# EAGLE design board (EAGLE 6.4)

## Sheet 1 of 3
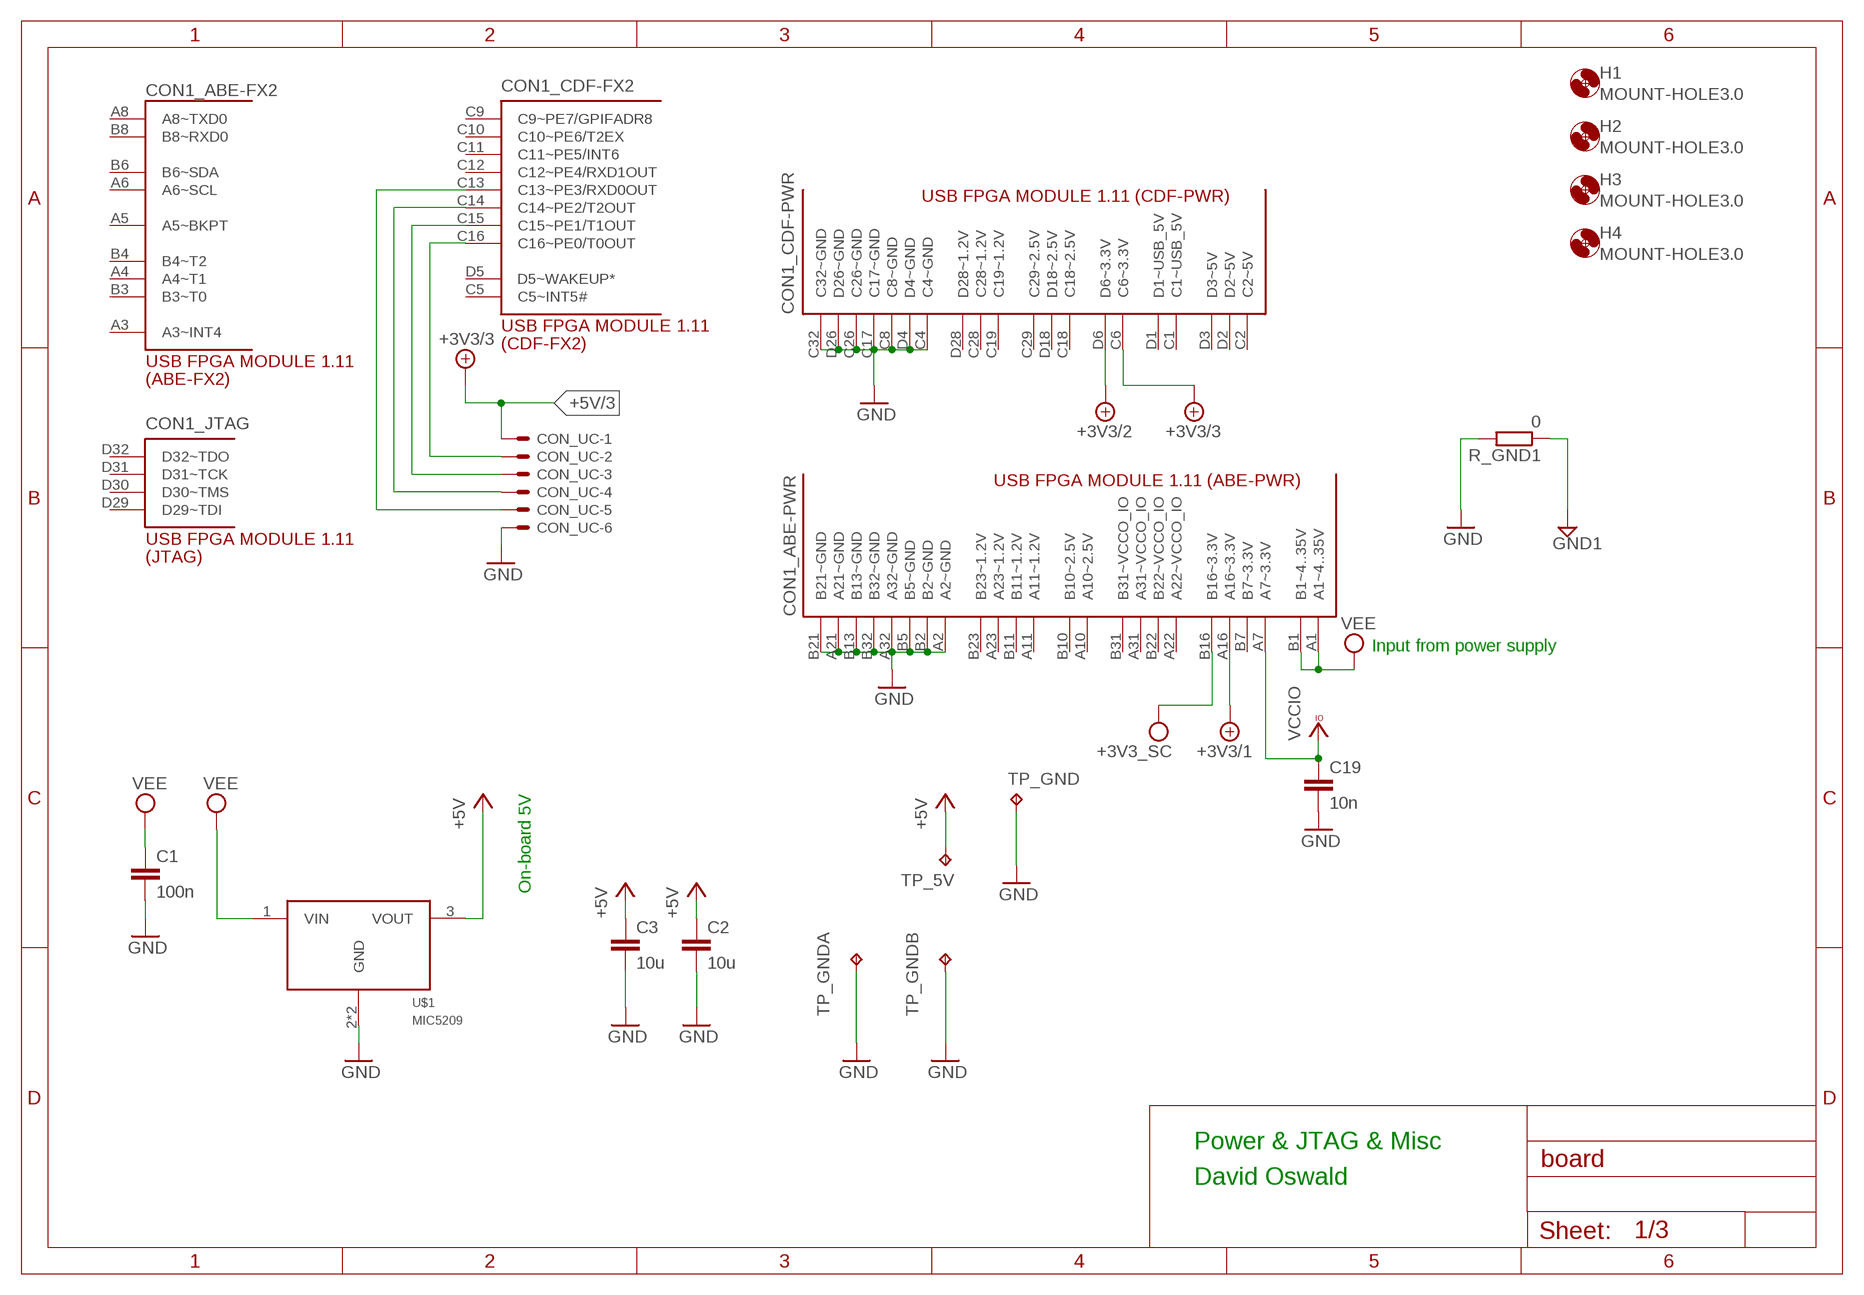
[diagram p0: schematic, sheet 1]

### Parts
C1  100n  C-EUC0805K  [C0805K]
C2  10u  C-EUC0805K  [C0805K]
C3  10u  C-EUC0805K  [C0805K]
C19  10n  C-EUC0805K  [C0805K]
CON1  USB-FPGA1.11  [USB-FPGA1.11]
CON_UC  22-23-2061  [22-23-2061]
H1  MOUNT-HOLE3.0  [3,0]
H2  MOUNT-HOLE3.0  [3,0]
H3  MOUNT-HOLE3.0  [3,0]
H4  MOUNT-HOLE3.0  [3,0]
R_GND1  0  R-EU_R0805  [R0805]
TP_5V  TPB1,27  [B1,27]
TP_GND  TPB1,27  [B1,27]
TP_GNDA  TPPAD1-13  [P1-13]
TP_GNDB  TPPAD1-13  [P1-13]
U$1  MIC5209  [SOT223-3]

### Nets
+5V: C2.1 C3.1 TP_5V.TP U$1.3(VOUT) ; also sheet 2,3
+5V/1: CON1.A16(_ABE-PWR:A16~3.3V) ; supply symbol labelled +3V3/1 ; also sheet 2
+5V/2: CON1.D6(_CDF-PWR:D6~3.3V) ; supply symbol labelled +3V3/2 ; also sheet 3
+5V/3: CON1.C6(_CDF-PWR:C6~3.3V) CON_UC.1 ; supply symbol labelled +3V3/3 ; also sheet 3
GND: C1.2 C2.2 C3.2 C19.2 CON1.A2(_ABE-PWR:A2~GND) CON1.A21(_ABE-PWR:A21~GND) CON1.A32(_ABE-PWR:A32~GND) CON1.B2(_ABE-PWR:B2~GND) CON1.B5(_ABE-PWR:B5~GND) CON1.B13(_ABE-PWR:B13~GND) CON1.B21(_ABE-PWR:B21~GND) CON1.B32(_ABE-PWR:B32~GND) CON1.C4(_CDF-PWR:C4~GND) CON1.C8(_CDF-PWR:C8~GND) CON1.C17(_CDF-PWR:C17~GND) CON1.C26(_CDF-PWR:C26~GND) CON1.C32(_CDF-PWR:C32~GND) CON1.D4(_CDF-PWR:D4~GND) CON1.D26(_CDF-PWR:D26~GND) CON_UC.6 R_GND1.2 TP_GND.TP TP_GNDA.TP TP_GNDB.TP U$1.2(GND) U$1.4(GND) ; also sheet 2,3
GND1: R_GND1.1 ; also sheet 2
N$60: CON1.C13(_CDF-FX2:C13~PE3/RXD0OUT) CON_UC.5
N$61: CON1.C14(_CDF-FX2:C14~PE2/T2OUT) CON_UC.4
N$62: CON1.C15(_CDF-FX2:C15~PE1/T1OUT) CON_UC.3
N$63: CON1.C16(_CDF-FX2:C16~PE0/T0OUT) CON_UC.2
VCCIO: C19.1 CON1.A7(_ABE-PWR:A7~3.3V) ; also sheet 2
VEE: C1.1 CON1.A1(_ABE-PWR:A1~4..35V) CON1.B1(_ABE-PWR:B1~4..35V) U$1.1(VIN)
VPP: CON1.B16(_ABE-PWR:B16~3.3V) ; supply symbol labelled +3V3_SC ; also sheet 3
Unconnected: CON1.A3(_ABE-FX2:A3~INT4) CON1.A4(_ABE-FX2:A4~T1) CON1.A5(_ABE-FX2:A5~BKPT) CON1.A6(_ABE-FX2:A6~SCL) CON1.A8(_ABE-FX2:A8~TXD0) CON1.A10(_ABE-PWR:A10~2.5V) CON1.A11(_ABE-PWR:A11~1.2V) CON1.A22(_ABE-PWR:A22~VCCO_IO) CON1.A23(_ABE-PWR:A23~1.2V) CON1.A31(_ABE-PWR:A31~VCCO_IO) CON1.B3(_ABE-FX2:B3~T0) CON1.B4(_ABE-FX2:B4~T2) CON1.B6(_ABE-FX2:B6~SDA) CON1.B7(_ABE-PWR:B7~3.3V) CON1.B8(_ABE-FX2:B8~RXD0) CON1.B10(_ABE-PWR:B10~2.5V) CON1.B11(_ABE-PWR:B11~1.2V) CON1.B22(_ABE-PWR:B22~VCCO_IO) CON1.B23(_ABE-PWR:B23~1.2V) CON1.B31(_ABE-PWR:B31~VCCO_IO) CON1.C1(_CDF-PWR:C1~USB_5V) CON1.C2(_CDF-PWR:C2~5V) CON1.C5(_CDF-FX2:C5~INT5#) CON1.C9(_CDF-FX2:C9~PE7/GPIFADR8) CON1.C10(_CDF-FX2:C10~PE6/T2EX) CON1.C11(_CDF-FX2:C11~PE5/INT6) CON1.C12(_CDF-FX2:C12~PE4/RXD1OUT) CON1.C18(_CDF-PWR:C18~2.5V) CON1.C19(_CDF-PWR:C19~1.2V) CON1.C28(_CDF-PWR:C28~1.2V) CON1.C29(_CDF-PWR:C29~2.5V) CON1.D1(_CDF-PWR:D1~USB_5V) CON1.D2(_CDF-PWR:D2~5V) CON1.D3(_CDF-PWR:D3~5V) CON1.D5(_CDF-FX2:D5~WAKEUP*) CON1.D18(_CDF-PWR:D18~2.5V) CON1.D28(_CDF-PWR:D28~1.2V) CON1.D29(_JTAG:D29~TDI) CON1.D30(_JTAG:D30~TMS) CON1.D31(_JTAG:D31~TCK) CON1.D32(_JTAG:D32~TDO)

### Notes on the sheet
- Input from power supply
- On-board 5V
- Power & JTAG & Misc
- David Oswald

## Sheet 2 of 3
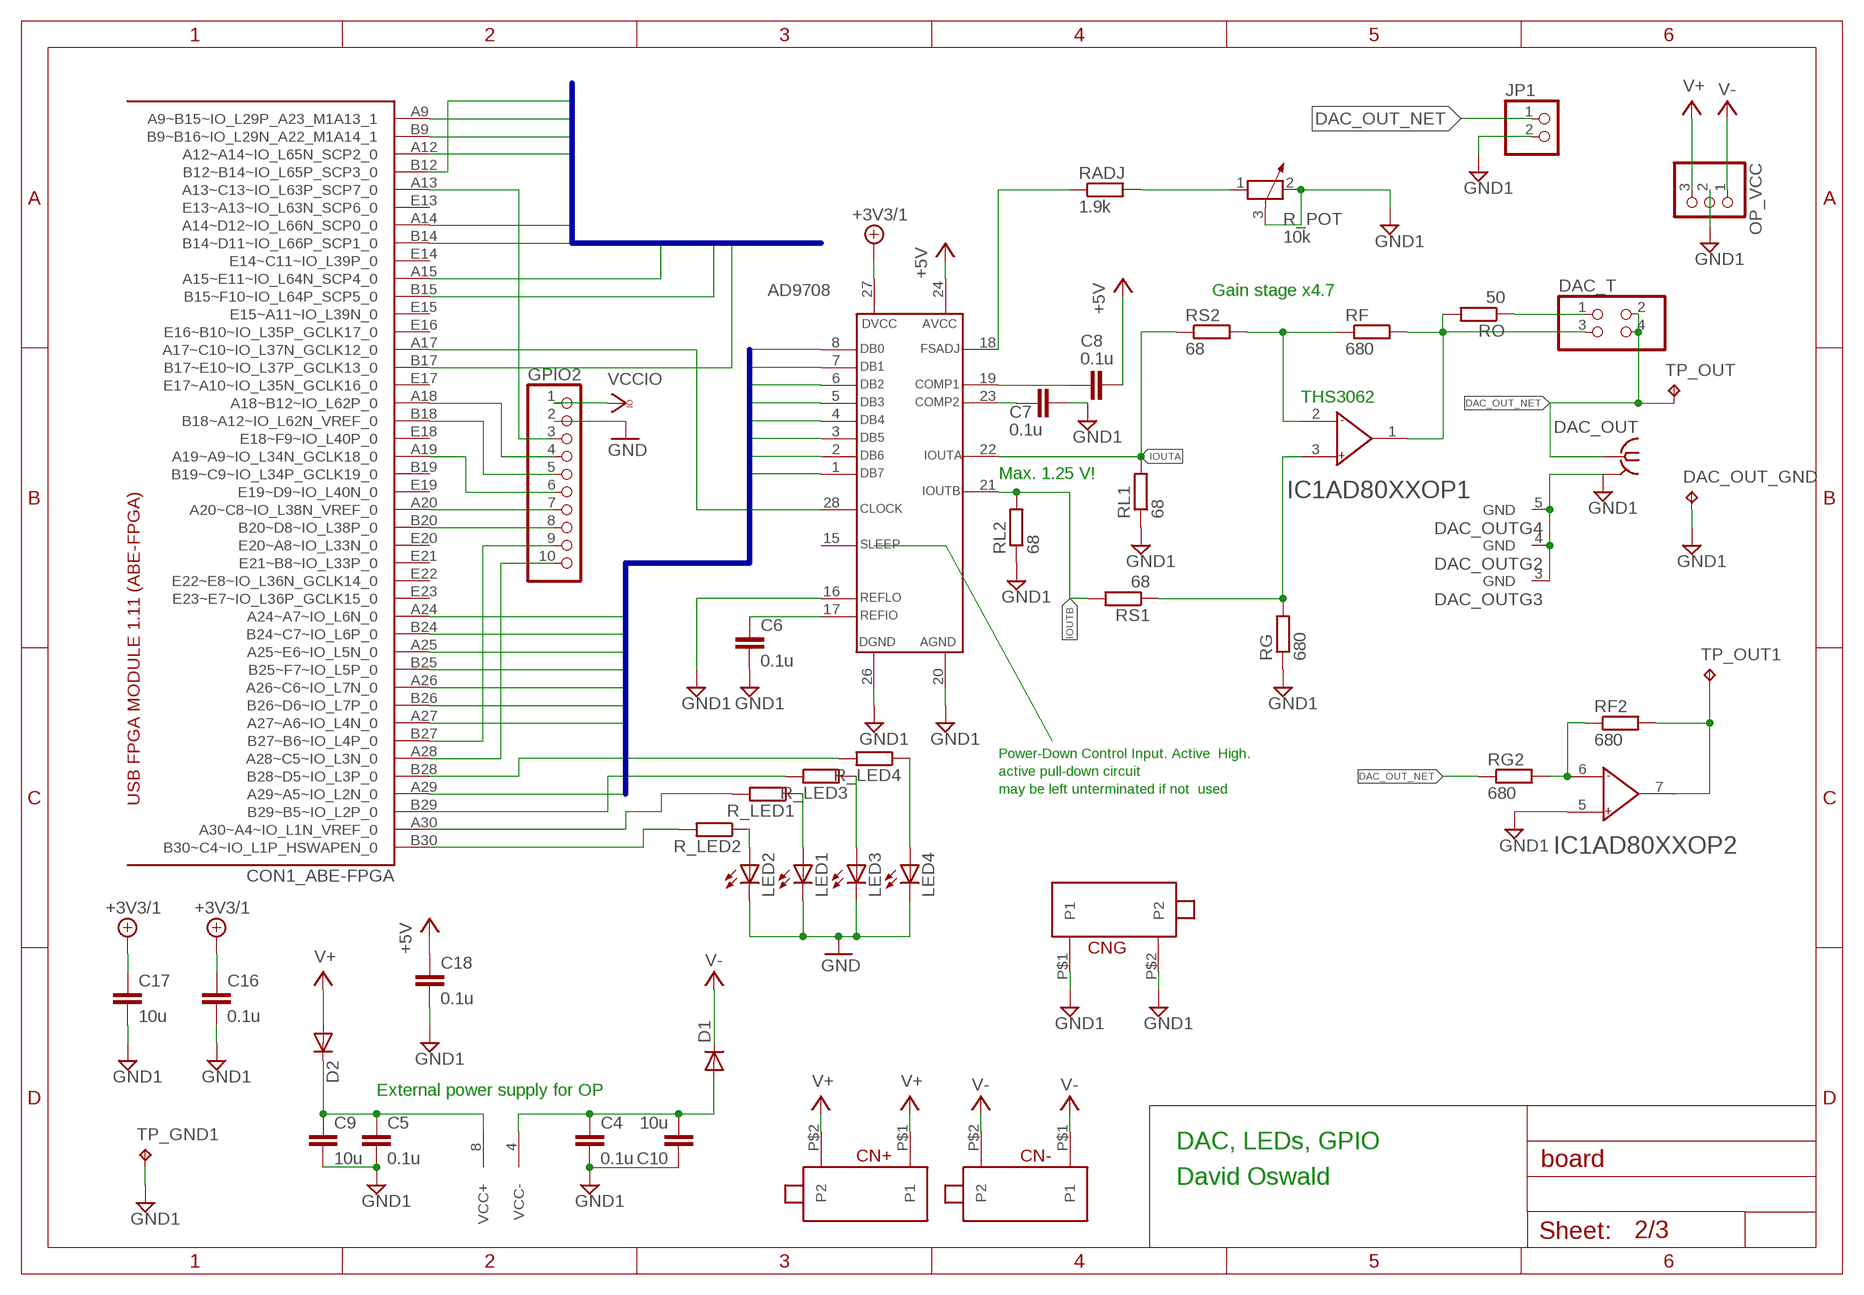
[diagram p1: schematic, sheet 2]

### Parts
AD9708  AD7908  [SO28W]
C4  0.1u  C-EUC0805K  [C0805K]
C5  0.1u  C-EUC0805K  [C0805K]
C6  0.1u  C-EUC0805K  [C0805K]
C7  0.1u  C-EUC0805K  [C0805K]
C8  0.1u  C-EUC0805K  [C0805K]
C9  10u  C-EUC0805K  [C0805K]
C10  10u  C-EUC0805K  [C0805K]
C16  0.1u  C-EUC0805K  [C0805K]
C17  10u  C-EUC0805K  [C0805K]
C18  0.1u  C-EUC0805K  [C0805K]
CN+  24243  [24_243]
CN-  24243  [24_243]
CNG  24243  [24_243]
D1  DIODE-SOD123  [SOD123]
D2  DIODE-SOD123  [SOD123]
DAC_OUT  BU-SMA-V  [BU-SMA-V]
DAC_OUT_GND  TPB1,27  [B1,27]
DAC_T  PINHD-2X2  [2X02]
GPIO2  PINHD-1X10  [1X10]
IC1  AD80XX  [SO08]
JP1  PINHD-1X2  [1X02]
LED1  LEDCHIPLED_0805  [CHIPLED_0805]
LED2  LEDCHIPLED_0805  [CHIPLED_0805]
LED3  LEDCHIPLED_0805  [CHIPLED_0805]
LED4  LEDCHIPLED_0805  [CHIPLED_0805]
OP_VCC  PINHD-1X3  [1X03]
R_LED1  R-EU_R0805  [R0805]
R_LED2  R-EU_R0805  [R0805]
R_LED3  R-EU_R0805  [R0805]
R_LED4  R-EU_R0805  [R0805]
R_POT  10k  POTENTIOMETER_PT_SPIN  [PT-SPIN]
RADJ  1.9k  R-EU_R0805  [R0805]
RF  680  R-EU_R0805  [R0805]
RF2  680  R-EU_R0805  [R0805]
RG  680  R-EU_R0805  [R0805]
RG2  680  R-EU_R0805  [R0805]
RL1  68  R-EU_R0805  [R0805]
RL2  68  R-EU_R0805  [R0805]
RO  50  R-EU_R0805  [R0805]
RS1  68  R-EU_R0805  [R0805]
RS2  68  R-EU_R0805  [R0805]
TP_GND1  TPB1,27  [B1,27]
TP_OUT  TPB1,27  [B1,27]
TP_OUT1  TPB1,27  [B1,27]

### Nets
+5V: AD9708.24(AVCC) C8.1 C18.1 ; also sheet 1,3
+5V/1: AD9708.27(DVCC) C16.1 C17.1 ; supply symbol labelled +3V3/1 ; also sheet 1
CLK: AD9708.28(CLOCK) CON1.A17(_ABE-FPGA:A17~C10~IO_L37N_GCLK12_0)
CLK_SC: CON1.A15(_ABE-FPGA:A15~E11~IO_L64N_SCP4_0) ; also sheet 3
COMP1: AD9708.19(COMP1) C8.2
COMP2: AD9708.23(COMP2) C7.1
DAC_OUT_NET: DAC_OUT.1 DAC_T.2 DAC_T.4 JP1.1 RG2.1 TP_OUT.TP
DB0: AD9708.8(DB0) CON1.A29(_ABE-FPGA:A29~A5~IO_L2N_0)
DB1: AD9708.7(DB1) CON1.A27(_ABE-FPGA:A27~A6~IO_L4N_0)
DB2: AD9708.6(DB2) CON1.B26(_ABE-FPGA:B26~D6~IO_L7P_0)
DB3: AD9708.5(DB3) CON1.A26(_ABE-FPGA:A26~C6~IO_L7N_0)
DB4: AD9708.4(DB4) CON1.A25(_ABE-FPGA:A25~E6~IO_L5N_0)
DB5: AD9708.3(DB5) CON1.B25(_ABE-FPGA:B25~F7~IO_L5P_0)
DB6: AD9708.2(DB6) CON1.A24(_ABE-FPGA:A24~A7~IO_L6N_0)
DB7: AD9708.1(DB7) CON1.B24(_ABE-FPGA:B24~C7~IO_L6P_0)
FSADJ: AD9708.18(FSADJ) RADJ.1
GND: GPIO2.2 LED1.C LED2.C LED3.C LED4.C ; also sheet 1,3
GND1: AD9708.16(REFLO) AD9708.20(AGND) AD9708.26(DGND) C4.2 C5.2 C6.2 C7.2 C9.2 C10.1 C16.2 C17.2 C18.2 CNG.P$1(P1) CNG.P$2(P2) DAC_OUT.2(GND) DAC_OUT.3(GND) DAC_OUT.4(GND) DAC_OUT.5(GND) DAC_OUT_GND.TP IC1.5(AD80XXOP2:IN+) JP1.2 OP_VCC.2 R_POT.2 R_POT.3 RG.1 RL1.1 RL2.1 TP_GND1.TP ; also sheet 1
IO: CON1.B9(_ABE-FPGA:B9~B16~IO_L29N_A22_M1A14_1) ; also sheet 3
IOUTA: AD9708.22(IOUTA) RL1.2 RS2.1
IOUTB: AD9708.21(IOUTB) RL2.2 RS1.2
N$1: CON1.A13(_ABE-FPGA:A13~C13~IO_L63P_SCP7_0) GPIO2.3
N$2: CON1.A18(_ABE-FPGA:A18~B12~IO_L62P_0) GPIO2.4
N$3: CON1.B18(_ABE-FPGA:B18~A12~IO_L62N_VREF_0) GPIO2.5
N$4: CON1.A19(_ABE-FPGA:A19~A9~IO_L34N_GCLK18_0) GPIO2.6
N$5: CON1.A20(_ABE-FPGA:A20~C8~IO_L38N_VREF_0) GPIO2.7
N$6: CON1.B20(_ABE-FPGA:B20~D8~IO_L38P_0) GPIO2.8
N$8: CON1.B27(_ABE-FPGA:B27~B6~IO_L4P_0) GPIO2.9
N$9: CON1.A28(_ABE-FPGA:A28~C5~IO_L3N_0) GPIO2.10
N$10: IC1.3(AD80XXOP1:IN+) RG.2 RS1.1
N$11: IC1.2(AD80XXOP1:IN-) RF.1 RS2.2
N$12: DAC_T.3 IC1.1(AD80XXOP1:OUT) RF.2 RO.2
N$18: DAC_T.1 RO.1
N$19: R_POT.1 RADJ.2
N$24: IC1.6(AD80XXOP2:IN-) RF2.1 RG2.2
N$33: IC1.7(AD80XXOP2:OUT) RF2.2 TP_OUT1.TP
N$34: LED2.A R_LED2.1
N$35: LED1.A R_LED1.1
N$50: LED3.A R_LED3.1
N$51: LED4.A R_LED4.1
N$53: CON1.B30(_ABE-FPGA:B30~C4~IO_L1P_HSWAPEN_0) R_LED2.2
N$54: CON1.A30(_ABE-FPGA:A30~A4~IO_L1N_VREF_0) R_LED1.2
N$55: CON1.B29(_ABE-FPGA:B29~B5~IO_L2P_0) R_LED3.2
N$56: CON1.B28(_ABE-FPGA:B28~D5~IO_L3P_0) R_LED4.2
PIN4: CON1.B14(_ABE-FPGA:B14~D11~IO_L66P_SCP1_0) ; also sheet 3
PIN6: CON1.A12(_ABE-FPGA:A12~A14~IO_L65N_SCP2_0) ; also sheet 3
PIN8: CON1.A9(_ABE-FPGA:A9~B15~IO_L29P_A23_M1A13_1) ; also sheet 3
REFIO: AD9708.17(REFIO) C6.1
RST: CON1.B15(_ABE-FPGA:B15~F10~IO_L64P_SCP5_0) ; also sheet 3
SHDN: CON1.B17(_ABE-FPGA:B17~E10~IO_L37P_GCLK13_0) ; also sheet 3
SW1: CON1.B12(_ABE-FPGA:B12~B14~IO_L65P_SCP3_0)
SW2: CON1.A14(_ABE-FPGA:A14~D12~IO_L66N_SCP0_0)
V+: CN+.P$1(P1) CN+.P$2(P2) D2.A OP_VCC.3
V-: CN-.P$1(P1) CN-.P$2(P2) D1.C OP_VCC.1
VCC+: C5.1 C9.1 D2.C IC1.8(SUPPLY:VCC+)
VCC-: C4.1 C10.2 D1.A IC1.4(SUPPLY:VCC-)
VCCIO: GPIO2.1 ; also sheet 1
Unconnected: AD9708.15(SLEEP) CON1.B19(_ABE-FPGA:B19~C9~IO_L34P_GCLK19_0) CON1.E13(_ABE-FPGA:E13~A13~IO_L63N_SCP6_0) CON1.E14(_ABE-FPGA:E14~C11~IO_L39P_0) CON1.E15(_ABE-FPGA:E15~A11~IO_L39N_0) CON1.E16(_ABE-FPGA:E16~B10~IO_L35P_GCLK17_0) CON1.E17(_ABE-FPGA:E17~A10~IO_L35N_GCLK16_0) CON1.E18(_ABE-FPGA:E18~F9~IO_L40P_0) CON1.E19(_ABE-FPGA:E19~D9~IO_L40N_0) CON1.E20(_ABE-FPGA:E20~A8~IO_L33N_0) CON1.E21(_ABE-FPGA:E21~B8~IO_L33P_0) CON1.E22(_ABE-FPGA:E22~E8~IO_L36N_GCLK14_0) CON1.E23(_ABE-FPGA:E23~E7~IO_L36P_GCLK15_0)

### Buses
DB0,DB1,DB2,DB3,DB4,DB5,DB6,DB7
SW1,SW2,PIN8,PIN4,IO,CLK_SC,PIN6,RST,SHDN

### Notes on the sheet
- Gain stage x4.7
- THS3062
- Max. 1.25 V!
- Power-Down Control Input. Active  High.
- active pull-down circuit
- may be left unterminated if not  used
- External power supply for OP
- DAC, LEDs, GPIO
- David Oswald

## Sheet 3 of 3
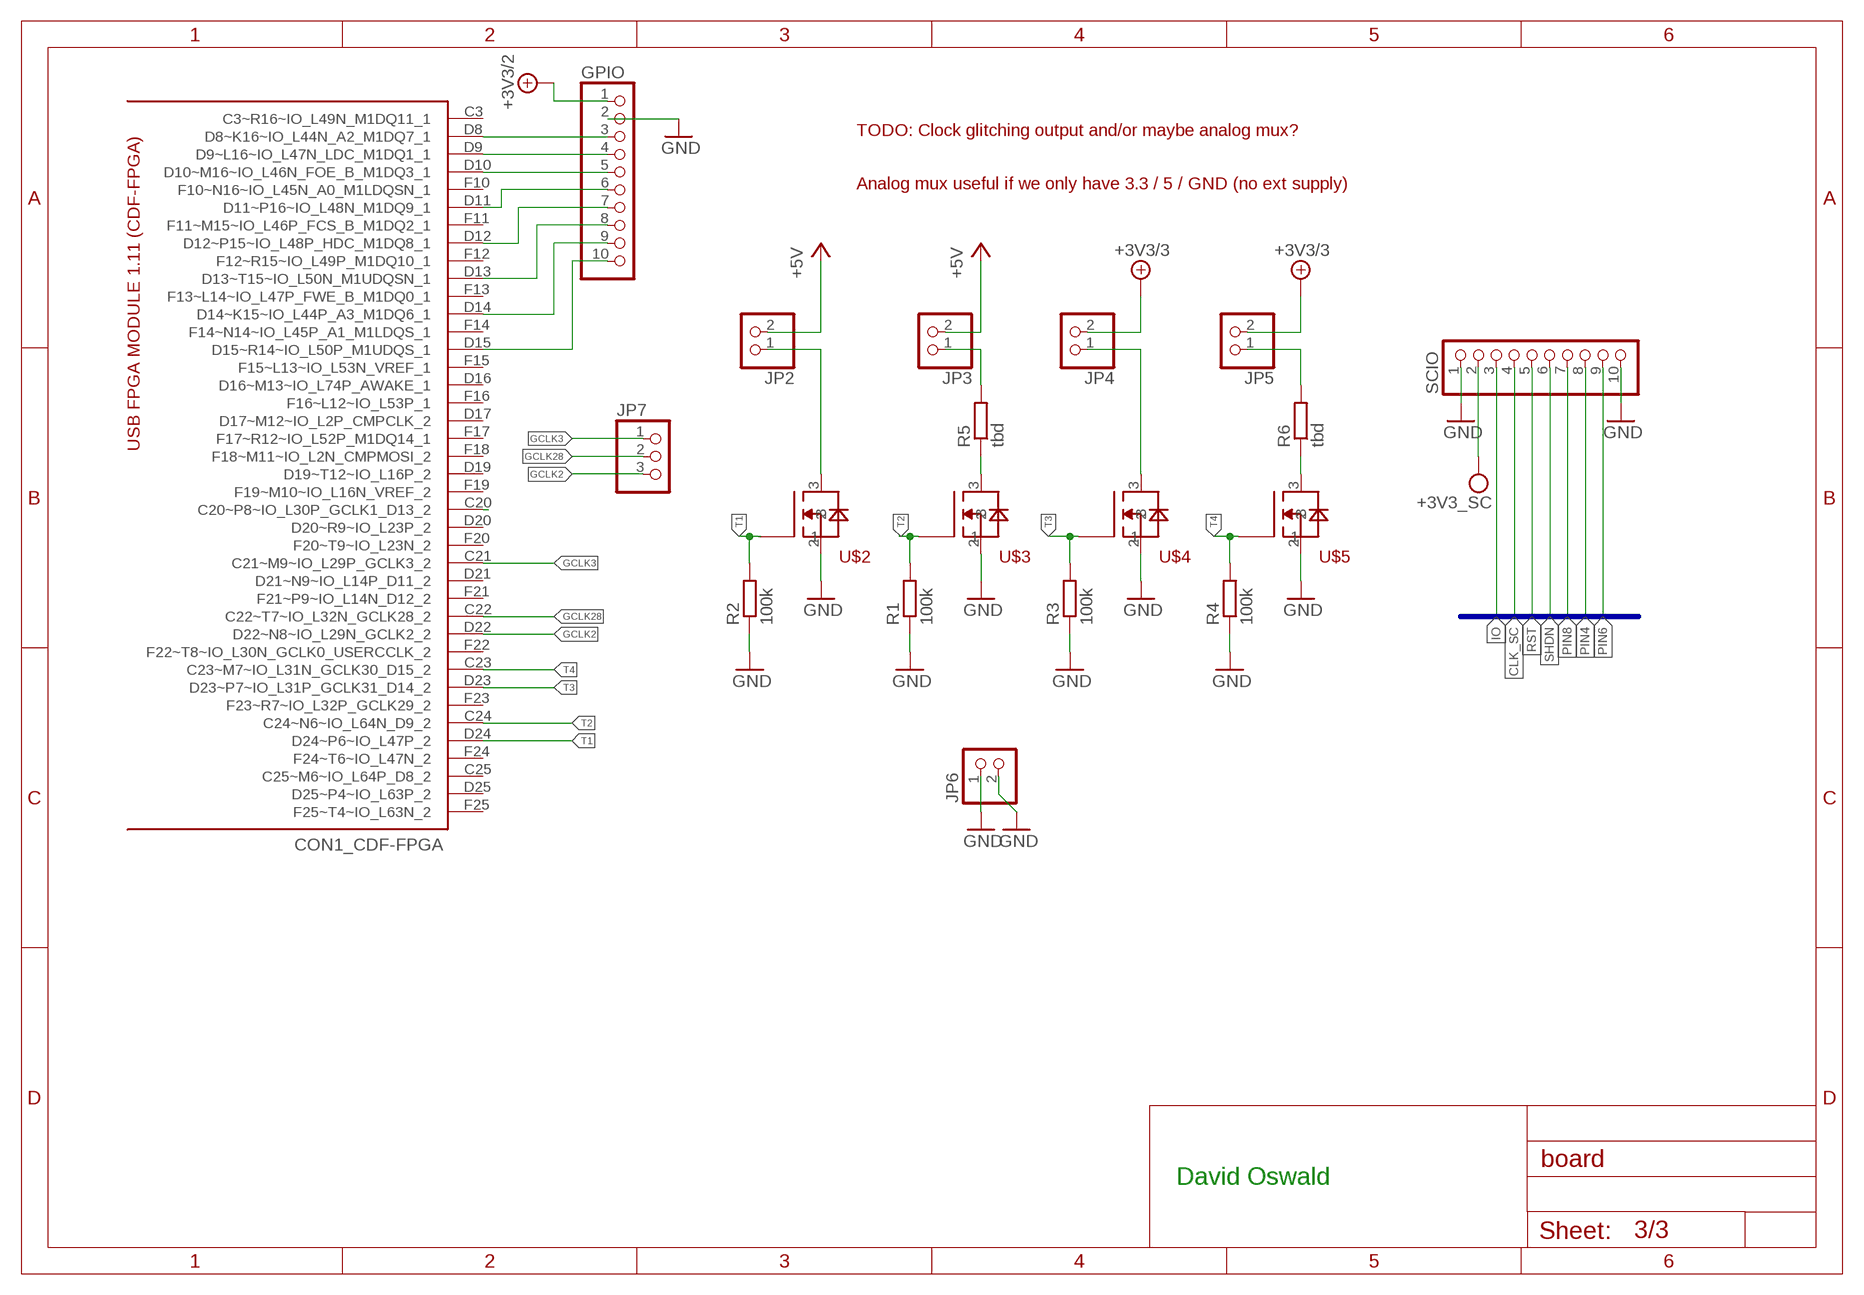
[diagram p2: schematic, sheet 3]

### Parts
GPIO  PINHD-1X10  [1X10]
JP2  PINHD-1X2  [1X02]
JP3  PINHD-1X2  [1X02]
JP4  PINHD-1X2  [1X02]
JP5  PINHD-1X2  [1X02]
JP6  PINHD-1X2  [1X02]
JP7  PINHD-1X3  [1X03]
R1  100k  R-EU_M0805  [M0805]
R2  100k  R-EU_M0805  [M0805]
R3  100k  R-EU_M0805  [M0805]
R4  100k  R-EU_M0805  [M0805]
R5  tbd  R-EU_M0805  [M0805]
R6  tbd  R-EU_M0805  [M0805]
SCIO  PINHD-1X10  [1X10]
U$2  DMG1012UW  [DMG1012UW1-SMT323]
U$3  DMG1012UW  [DMG1012UW1-SMT323]
U$4  DMG1012UW  [DMG1012UW1-SMT323]
U$5  DMG1012UW  [DMG1012UW1-SMT323]

### Nets
+5V: JP2.2 JP3.2 ; also sheet 1,2
+5V/2: GPIO.1 ; supply symbol labelled +3V3/2 ; also sheet 1
+5V/3: JP4.2 JP5.2 ; supply symbol labelled +3V3/3 ; also sheet 1
CLK_SC: SCIO.4 ; also sheet 2
GCLK2: CON1.D22(_CDF-FPGA:D22~N8~IO_L29N_GCLK2_2) JP7.3
GCLK3: CON1.C21(_CDF-FPGA:C21~M9~IO_L29P_GCLK3_2) JP7.1
GCLK28: CON1.C22(_CDF-FPGA:C22~T7~IO_L32N_GCLK28_2) JP7.2
GND: GPIO.2 JP6.1 JP6.2 R1.1 R2.1 R3.1 R4.1 SCIO.1 SCIO.10 U$2.2 U$3.2 U$4.2 U$5.2 ; also sheet 1,2
IO: SCIO.3 ; also sheet 2
N$14: R5.1 U$3.3
N$15: JP2.1 U$2.3
N$16: JP3.1 R5.2
N$20: R6.1 U$5.3
N$22: JP4.1 U$4.3
N$23: JP5.1 R6.2
N$25: CON1.D8(_CDF-FPGA:D8~K16~IO_L44N_A2_M1DQ7_1) GPIO.3
N$26: CON1.D9(_CDF-FPGA:D9~L16~IO_L47N_LDC_M1DQ1_1) GPIO.4
N$27: CON1.D10(_CDF-FPGA:D10~M16~IO_L46N_FOE_B_M1DQ3_1) GPIO.5
N$28: CON1.D11(_CDF-FPGA:D11~P16~IO_L48N_M1DQ9_1) GPIO.6
N$29: CON1.D12(_CDF-FPGA:D12~P15~IO_L48P_HDC_M1DQ8_1) GPIO.7
N$30: CON1.D13(_CDF-FPGA:D13~T15~IO_L50N_M1UDQSN_1) GPIO.8
N$31: CON1.D14(_CDF-FPGA:D14~K15~IO_L44P_A3_M1DQ6_1) GPIO.9
N$32: CON1.D15(_CDF-FPGA:D15~R14~IO_L50P_M1UDQS_1) GPIO.10
N$69: CON1.C20(_CDF-FPGA:C20~P8~IO_L30P_GCLK1_D13_2)
PIN4: SCIO.8 ; also sheet 2
PIN6: SCIO.9 ; also sheet 2
PIN8: SCIO.7 ; also sheet 2
RST: SCIO.5 ; also sheet 2
SHDN: SCIO.6 ; also sheet 2
T1: CON1.D24(_CDF-FPGA:D24~P6~IO_L47P_2) R2.2 U$2.1
T2: CON1.C24(_CDF-FPGA:C24~N6~IO_L64N_D9_2) R1.2 U$3.1
T3: CON1.D23(_CDF-FPGA:D23~P7~IO_L31P_GCLK31_D14_2) R3.2 U$4.1
T4: CON1.C23(_CDF-FPGA:C23~M7~IO_L31N_GCLK30_D15_2) R4.2 U$5.1
VPP: SCIO.2 ; supply symbol labelled +3V3_SC ; also sheet 1
Unconnected: CON1.C3(_CDF-FPGA:C3~R16~IO_L49N_M1DQ11_1) CON1.C25(_CDF-FPGA:C25~M6~IO_L64P_D8_2) CON1.D16(_CDF-FPGA:D16~M13~IO_L74P_AWAKE_1) CON1.D17(_CDF-FPGA:D17~M12~IO_L2P_CMPCLK_2) CON1.D19(_CDF-FPGA:D19~T12~IO_L16P_2) CON1.D20(_CDF-FPGA:D20~R9~IO_L23P_2) CON1.D21(_CDF-FPGA:D21~N9~IO_L14P_D11_2) CON1.D25(_CDF-FPGA:D25~P4~IO_L63P_2) CON1.F10(_CDF-FPGA:F10~N16~IO_L45N_A0_M1LDQSN_1) CON1.F11(_CDF-FPGA:F11~M15~IO_L46P_FCS_B_M1DQ2_1) CON1.F12(_CDF-FPGA:F12~R15~IO_L49P_M1DQ10_1) CON1.F13(_CDF-FPGA:F13~L14~IO_L47P_FWE_B_M1DQ0_1) CON1.F14(_CDF-FPGA:F14~N14~IO_L45P_A1_M1LDQS_1) CON1.F15(_CDF-FPGA:F15~L13~IO_L53N_VREF_1) CON1.F16(_CDF-FPGA:F16~L12~IO_L53P_1) CON1.F17(_CDF-FPGA:F17~R12~IO_L52P_M1DQ14_1) CON1.F18(_CDF-FPGA:F18~M11~IO_L2N_CMPMOSI_2) CON1.F19(_CDF-FPGA:F19~M10~IO_L16N_VREF_2) CON1.F20(_CDF-FPGA:F20~T9~IO_L23N_2) CON1.F21(_CDF-FPGA:F21~P9~IO_L14N_D12_2) CON1.F22(_CDF-FPGA:F22~T8~IO_L30N_GCLK0_USERCCLK_2) CON1.F23(_CDF-FPGA:F23~R7~IO_L32P_GCLK29_2) CON1.F24(_CDF-FPGA:F24~T6~IO_L47N_2) CON1.F25(_CDF-FPGA:F25~T4~IO_L63N_2)

### Buses
SW1,SW2,PIN8,PIN4,IO,CLK_SC,PIN6,RST,SHDN

### Notes on the sheet
- TODO: Clock glitching output and/or maybe analog mux?
- Analog mux useful if we only have 3.3 / 5 / GND (no ext supply)
- David Oswald

## Library data of the parts
AD9708 = ad9708:AD7908: AD9708 8-Bit DAC with current output http://www.analog.com/static/imported-files/data_sheets/AD9708.pdf
C1-C10 C16-C19 = rcl:C-EU: CAPACITOR, European symbol
CN+ CN- CNG = socket_24243:24243: Multicomp 24.243 Series https://uk.farnell.com/multicomp/24-243-2/receptacle-20a-4mm-pcb-solder/dp/1698983
CON1 = usb-fpga-1:USB-FPGA1.11
CON_UC = con-molex:22-23-2061: .100" (2.54mm) Center Header - 6 Pin
D1 D2 = diode:DIODE-: DIODE
DAC_OUT = con-coax:BU-SMA-V: FEMALE SMA CONNECTOR Radiall distributor RS 112-3794; OC_FARNELL: unknown; OC_NEWARK: unknown
DAC_OUT_GND TP_5V TP_GND TP_GND1 TP_GNDA TP_GNDB TP_OUT TP_OUT1 = testpad:TP: Test pad
DAC_T = pinhead:PINHD-2X2: PIN HEADER
GPIO GPIO2 SCIO = pinhead:PINHD-1X10: PIN HEADER
H1-H4 = holes:MOUNT-HOLE: MOUNTING HOLE with drill center marker
IC1 = ad80xx:AD80XX: AD high bandwidth dual opamp
JP1-JP6 = pinhead:PINHD-1X2: PIN HEADER
JP7 OP_VCC = pinhead:PINHD-1X3: PIN HEADER
LED1-LED4 = led:LED: LED OSRAM: - CHIPLED LG R971, LG N971, LY N971, LG Q971, LY Q971, LO R971, LY R971 LH N974, LH R974 LS Q976, LO Q976, LY Q976 LO Q996 - Hyper CHIPLED LW Q18S LB Q993, LB Q99A, LB R99A - SideLED LS A670, LO A670, LY A670, LG A670, LP A670 LB A673, LV A673, LT A673, LW A673 LH A674 LY A675 LS A676, LA A676, LO A676, LY A676, LW A676 LS A679, LY A679, LG A679 - Hyper Micro SIDELED® LS Y876, LA Y876, LO Y876, LY Y876 LT Y87S - SmartLED LW L88C, LW L88S LB L89C, LB L89S, LG L890 LS L89K, LO L89K, LY L89K LS L896, LA L896, LO L896, LY L896 - TOPLED LS T670, LO T670, LY T670, LG T670, LP T670 LSG T670, LSP T670, LSY T670, LOP T670, LYG T670 LG T671, LOG T671, LSG T671 LB T673, LV T673, LT T673, LW T673 LH T674 LS T676, LA T676, LO T676, LY T676, LB T676, LH T676, LSB T676, LW T676 LB T67C, LV T67C, LT T67C, LS T67K, LO T67K, LY T67K, LW E67C LS E67B, LA E67B, LO E67B, LY E67B, LB E67C, LV E67C, LT E67C LW T67C LS T679, LY T679, LG T679 LS T770, LO T770, LY T770, LG T770, LP T770 LB T773, LV T773, LT T773, LW T773 LH T774 LS E675, LA E675, LY E675, LS T675 LS T776, LA T776, LO T776, LY T776, LB T776 LHGB T686 LT T68C, LB T68C - Hyper Mini TOPLED® LB M676 - Mini TOPLED Santana® LG M470 LS M47K, LO M47K, LY M47K Source: http://www.osram.convergy.de LUXEON: - LUMILED® LXK2-PW12-R00, LXK2-PW12-S00, LXK2-PW14-U00, LXK2-PW14-V00 LXK2-PM12-R00, LXK2-PM12-S00, LXK2-PM14-U00 LXK2-PE12-Q00, LXK2-PE12-R00, LXK2-PE12-S00, LXK2-PE14-T00, LXK2-PE14-U00 LXK2-PB12-K00, LXK2-PB12-L00, LXK2-PB12-M00, LXK2-PB14-N00, LXK2-PB14-P00, LXK2-PB14-Q00 LXK2-PR12-L00, LXK2-PR12-M00, LXK2-PR14-Q00, LXK2-PR14-R00 LXK2-PD12-Q00, LXK2-PD12-R00, LXK2-PD12-S00 LXK2-PH12-R00, LXK2-PH12-S00 LXK2-PL12-P00, LXK2-PL12-Q00, LXK2-PL12-R00 Source: www.luxeon.com KINGBRIGHT: KA-3528ASYC Source: www.kingbright.com
R1-R6 R_GND1 R_LED1-R_LED4 RADJ RF RF2 RG RG2 RL1 RL2 RO RS1 RS2 = rcl:R-EU_: RESISTOR, European symbol
R_POT = rcl:POTENTIOMETER_: Potentiometer
U$1 = mic5209:MIC5209
U$2-U$5 = DMG1012UW:DMG1012UW: NPN DMG1012UW Pin 1 = Gate Pin 2 = Source Pin 3 = Drain Datasheet: https://www.diodes.com/assets/Datasheets/ds31859.pdf

## Board
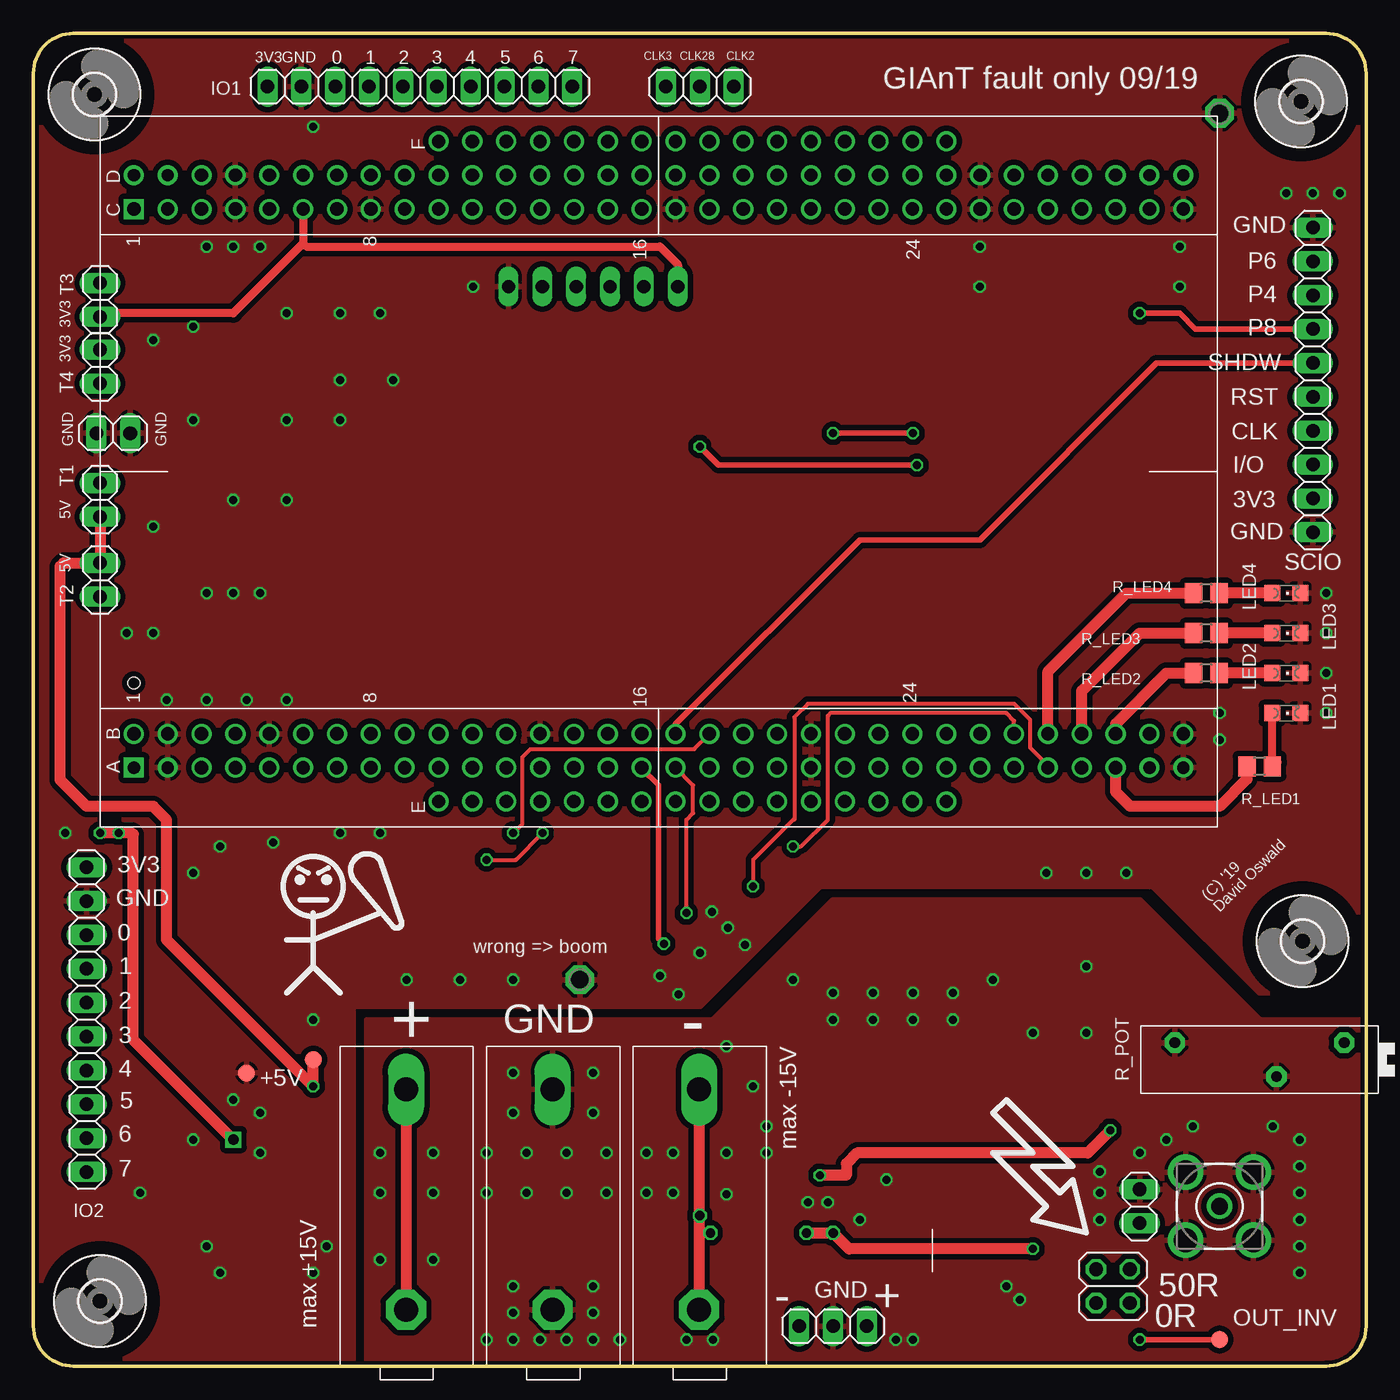
[diagram p3: board, top side]
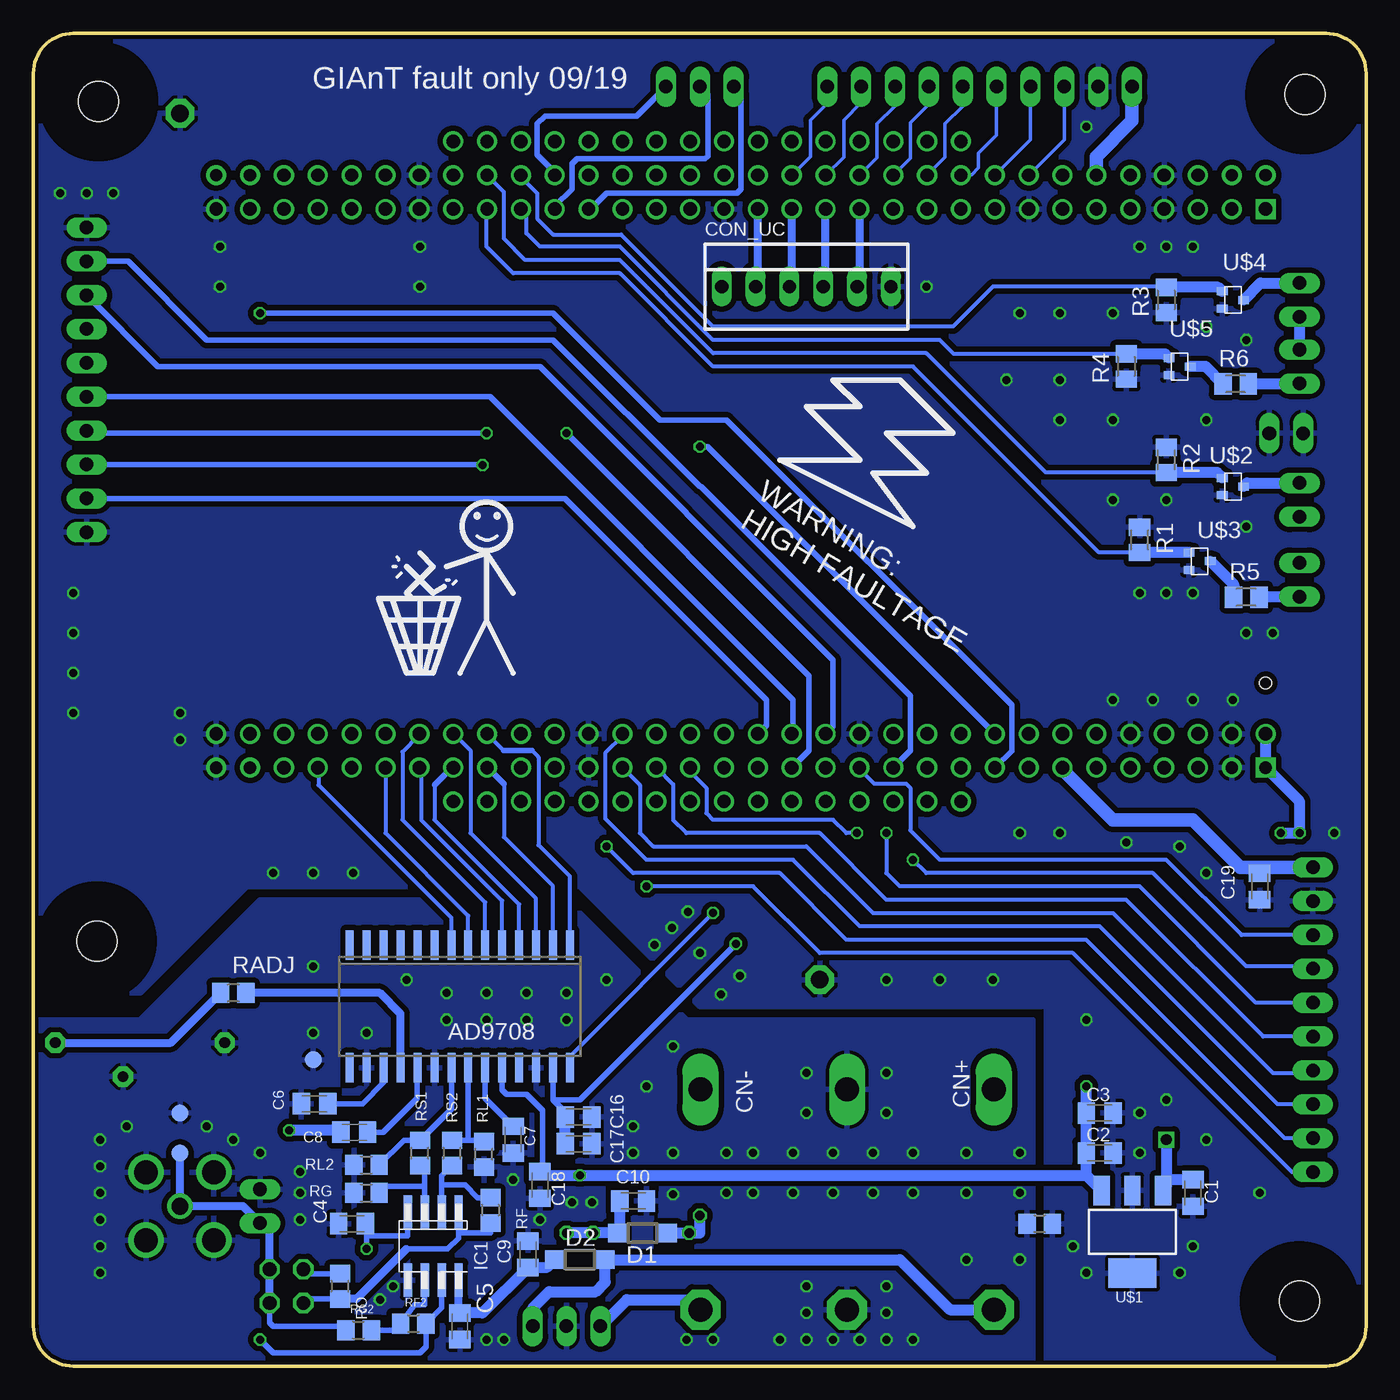
[diagram p4: board, bottom side, seen from below]

Size 100 x 100 mm. Coordinates in mm from the lower left corner, seen from the top.
Outline: 3,0 97,0 arc90 100,3 100,97 arc90 97,100 3,100 arc90 0,97 0,3 arc90 3,0
Copper layers (1*16): Top 0.035mm / dielectric 1.5mm / Bottom 0.035mm
Design rules "watterott_dirt_cheap_dirty_boards.v1": minimum track width 0.15mm, minimum drill 0.3mm, track to track 0.15mm, track to pad 0.15mm, pad to pad 0.15mm, via to via 0.15mm, smd to smd 0mil, copper to edge 0.3mm, drill to drill 10mil, minimum pad ring 10mil, minimum via ring 6mil, stop-mask expansion 2mil, vias tented up to drill 25mil, thermal gap 10mil
Milling: 8 lines

### Footprints (pad centres in the part's own frame; a part is rotated, then mirrored left to right if it is on the bottom)
SO28W = smd 0.6 x 2.2: 1 -8.255,-4.6; 2 -6.985,-4.6; 3 -5.715,-4.6; 4 -4.445,-4.6; 5 -3.175,-4.6; 6 -1.905,-4.6; 7 -0.635,-4.6; 8 0.635,-4.6; 9 1.905,-4.6; 10 3.175,-4.6; 11 4.445,-4.6; 12 5.715,-4.6; 13 6.985,-4.6; 14 8.255,-4.6; 15 8.255,4.6; 16 6.985,4.6; 17 5.715,4.6; 18 4.445,4.6; 19 3.175,4.6; 20 1.905,4.6; 21 0.635,4.6; 22 -0.635,4.6; 23 -1.905,4.6; 24 -3.175,4.6; 25 -4.445,4.6; 26 -5.715,4.6; 27 -6.985,4.6; 28 -8.255,4.6
C0805K = smd 1.3 x 1.6: 1 -1,0; 2 1,0
24_243 = drill 1.8 long: P$1 3.246,-6.05 | drill 1.8 pad 3 octagon: P$2 19.754,-6.05
USB-FPGA1.11 = drill 0.925 pad 1.5 square: A1 2.54,1.905 | drill 0.925 pad 1.5: A2 5.08,1.905; A31 78.74,1.905; A32 81.28,1.905; D1 2.54,46.355; D2 5.08,46.355; D31 78.74,46.355; D32 81.28,46.355 | drill 1 pad 1.5: A3 7.62,1.905; A4 10.16,1.905; A5 12.7,1.905; A6 15.24,1.905; A7 17.78,1.905; A8 20.32,1.905; A9 22.86,1.905; A10 25.4,1.905; A11 27.94,1.905; A12 30.48,1.905; A13 33.02,1.905; A14 35.56,1.905; A15 38.1,1.905; A16 40.64,1.905; A17 43.18,1.905; A18 45.72,1.905; A19 48.26,1.905; A20 50.8,1.905; A21 53.34,1.905; A22 55.88,1.905; A23 58.42,1.905; A24 60.96,1.905; A25 63.5,1.905; A26 66.04,1.905; A27 68.58,1.905; A28 71.12,1.905; A29 73.66,1.905; A30 76.2,1.905; B1 2.54,4.445; B2 5.08,4.445; B3 7.62,4.445; B4 10.16,4.445; B5 12.7,4.445; B6 15.24,4.445; B7 17.78,4.445; B8 20.32,4.445; B9 22.86,4.445; B10 25.4,4.445; B11 27.94,4.445; B12 30.48,4.445; B13 33.02,4.445; B14 35.56,4.445; B15 38.1,4.445; B16 40.64,4.445; B17 43.18,4.445; B18 45.72,4.445; B19 48.26,4.445; B20 50.8,4.445; B21 53.34,4.445; B22 55.88,4.445; B23 58.42,4.445; B24 60.96,4.445; B25 63.5,4.445; B26 66.04,4.445; B27 68.58,4.445; B28 71.12,4.445; B29 73.66,4.445; B30 76.2,4.445; B31 78.74,4.445; B32 81.28,4.445; C2 5.08,43.815; C3 7.62,43.815; C4 10.16,43.815; C5 12.7,43.815; C6 15.24,43.815; C7 17.78,43.815; C8 20.32,43.815; C9 22.86,43.815; C10 25.4,43.815; C11 27.94,43.815; C12 30.48,43.815; C13 33.02,43.815; C14 35.56,43.815; C15 38.1,43.815; C16 40.64,43.815; C17 43.18,43.815; C18 45.72,43.815; C19 48.26,43.815; C20 50.8,43.815; C21 53.34,43.815; C22 55.88,43.815; C23 58.42,43.815; C24 60.96,43.815; C25 63.5,43.815; C26 66.04,43.815; C27 68.58,43.815; C28 71.12,43.815; C29 73.66,43.815; C30 76.2,43.815; C31 78.74,43.815; C32 81.28,43.815; D3 7.62,46.355; D4 10.16,46.355; D5 12.7,46.355; D6 15.24,46.355; D7 17.78,46.355; D8 20.32,46.355; D9 22.86,46.355; D10 25.4,46.355; D11 27.94,46.355; D12 30.48,46.355; D13 33.02,46.355; D14 35.56,46.355; D15 38.1,46.355; D16 40.64,46.355; D17 43.18,46.355; D18 45.72,46.355; D19 48.26,46.355; D20 50.8,46.355; D21 53.34,46.355; D22 55.88,46.355; D23 58.42,46.355; D24 60.96,46.355; D25 63.5,46.355; D26 66.04,46.355; D27 68.58,46.355; D28 71.12,46.355; D29 73.66,46.355; D30 76.2,46.355; E10 25.4,-0.635; E11 27.94,-0.635; E12 30.48,-0.635; E13 33.02,-0.635; E14 35.56,-0.635; E15 38.1,-0.635; E16 40.64,-0.635; E17 43.18,-0.635; E18 45.72,-0.635; E19 48.26,-0.635; E20 50.8,-0.635; E21 53.34,-0.635; E22 55.88,-0.635; E23 58.42,-0.635; E24 60.96,-0.635; E25 63.5,-0.635; F10 25.4,48.895; F11 27.94,48.895; F12 30.48,48.895; F13 33.02,48.895; F14 35.56,48.895; F15 38.1,48.895; F16 40.64,48.895; F17 43.18,48.895; F18 45.72,48.895; F19 48.26,48.895; F20 50.8,48.895; F21 53.34,48.895; F22 55.88,48.895; F23 58.42,48.895; F24 60.96,48.895; F25 63.5,48.895 | drill 1 pad 1.5 square: C1 2.54,43.815 | hole 0.9: 2.54,8.255
22-23-2061 = drill 1 long: 1 -6.35,0; 2 -3.81,0; 3 -1.27,0; 4 1.27,0; 5 3.81,0; 6 6.35,0
SOD123 = smd 1.4 x 1.4: A 1.9,0; C -1.9,0
BU-SMA-V = drill 1.27: 1 0,0 | drill 1.778: 2 -2.55,2.55; 3 2.55,2.55; 4 2.55,-2.55; 5 -2.55,-2.55
B1,27 = smd 1.27 x 1.27: TP 0,0
2X02 = drill 1.016 octagon: 1 -1.27,-1.27; 2 -1.27,1.27; 3 1.27,-1.27; 4 1.27,1.27
1X10 = drill 1.016 long: 1 -11.43,0; 2 -8.89,0; 3 -6.35,0; 4 -3.81,0; 5 -1.27,0; 6 1.27,0; 7 3.81,0; 8 6.35,0; 9 8.89,0; 10 11.43,0
3,0 = hole 3: 0,0
SO08 = smd 0.635 x 2.54: 1 -1.905,-2.54; 2 -0.635,-2.54; 3 0.635,-2.54; 4 1.905,-2.54; 5 1.905,2.54; 6 0.635,2.54; 7 -0.635,2.54; 8 -1.905,2.54
1X02 = drill 1.016 long: 1 -1.27,0; 2 1.27,0
1X03 = drill 1.016 long: 1 -2.54,0; 2 0,0; 3 2.54,0
CHIPLED_0805 = smd 1.2 x 1.2: A 0,-1.05; C 0,1.05
M0805 = smd 1.3 x 1.6: 1 -0.95,0; 2 0.95,0
R0805 = smd 1.3 x 1.5: 1 -0.95,0; 2 0.95,0
PT-SPIN = drill 0.813 pad 1.524 octagon: 1 -6.35,-1.27; 2 6.35,-1.27; 3 -1.27,1.27
P1-13 = drill 1.321 pad 2.159 octagon: TP 0,0
SOT223-3 = smd 1.219 x 2.235: 1 0.229,-8.179; 2 2.54,-8.179; 3 4.851,-8.179 | smd 3.6 x 2.2: 4 2.54,-1.981
DMG1012UW1-SMT323 = smd 0.6 x 0.8: 1 -0.65,-0.8; 2 0.65,-0.8; 3 0,0.8

### Placement (x,y rotation side)
AD9708  68,27 180 bottom
C1  13,13 270 bottom
C2  20,16 0 bottom
C3  20,19 0 bottom
C4  76.1,10.7 180 bottom
C5  68,3 270 bottom
C6  78.9,19.7 180 bottom
C7  64,17 270 bottom
C8  75.92,17.55 0 bottom
C9  62.9,8.4 90 bottom
C10  55,12.4 180 bottom
C16  59.1,18.7 0 bottom
C17  59.1,16.7 0 bottom
C18  62,13.6 270 bottom
C19  8,36 270 bottom
CN+  34,24 270 top
CN-  56,24 270 top
CNG  45,24 270 top
CON1  5,43 0 top
CON_UC  42,81 0 bottom
D1  54.3,10 180 bottom
D2  59,8 0 bottom
DAC_OUT  89,12 0 top
DAC_OUT_GND  79,23 180 bottom
DAC_T  81,6 270 top
GPIO  29,96 0 top
GPIO2  4,26 270 top
H1  4.6,95.4 0 top
H2  5.01,4.88 0 top
H3  95.12,94.88 0 top
H4  95.23,31.88 0 top
IC1  70,9 180 bottom
JP1  83,12 90 top
JP2  5,65 270 top
JP3  5,59 90 top
JP4  5,80 270 top
JP5  5,75 90 top
JP6  6,70 180 top
JP7  50,96 0 top
LED1  94,49 270 top
LED2  94,52 270 top
LED3  94,55 270 top
LED4  94,58 270 top
OP_VCC  60,3 0 top
R1  17,62 270 bottom
R2  15,68 270 bottom
R3  15,80 90 bottom
R4  18,75 90 bottom
R5  9,57.7 0 bottom
R6  9.8,73.7 0 bottom
R_GND1  24.5,10.7 0 bottom
R_LED1  92,45 180 top
R_LED2  88,52 180 top
R_LED3  88,55 180 top
R_LED4  88,58 180 top
R_POT  92,23 180 top
RADJ  85,28 180 bottom
RF  65.7,11.7 270 bottom
RF2  71.5,3.2 0 bottom
RG  75,13 0 bottom
RG2  75.6,2.7 0 bottom
RL1  66.2,15.9 90 bottom
RL2  75,15.1 0 bottom
RO  77,6 270 bottom
RS1  71,16 90 bottom
RS2  68.6,16 270 bottom
SCIO  96,74 90 top
TP_5V  21,23 0 top
TP_GND  16,22 0 top
TP_GND1  89,19 0 bottom
TP_GNDA  41,29 0 top
TP_GNDB  89,94 0 top
TP_OUT  89,16 0 bottom
TP_OUT1  89,2 0 top
U$1  15,5 180 bottom
U$2  10,66 270 bottom
U$3  12.5,60.4 270 bottom
U$4  10,80 270 bottom
U$5  14,75 270 bottom

### Tracks (layer width: path | path; a pad name or v marks a point on that pad's centre or on a via)
+5V  (via drill 0.6)
  Top 0.813: v80.8,17.7 79.1,16 61.8,16 61,15.2 61,14.33 v59,14.33 | TP_5V.TP v21,21 10,32 10,41 9,42 4,42 2,44 2,60 2.27,60.27 JP3.2 JP2.2
  Bottom 0.406: AD9708.24 64.83,20.73 64.5,20.4 63,20.4 61.8,19.2 61.8,14.8 C18.1
  Bottom 0.813: U$1.3 21,14.33 | 21,14.33 C2.1 C3.1 v21,21 | 61.8,14.8 61.33,14.33 v59,14.33 21,14.33 | C8.1 77.07,17.7 v80.8,17.7
+5V/1  (via drill 0.6)
  Top 0.406: CON1.A16 45.64,44.86 46.9,43.6 46.9,32.1 v47.3,31.7
  Bottom 0.406: v47.3,31.7 59,20 61,20 | AD9708.27 61.1,22.32 61,22.21 61,20 | 61,20 60.1,19.1 C16.1
  Bottom 0.813: C17.1 C16.1
+5V/2
  Bottom 1.016: GPIO.1 17.57,93.43 20.24,90.76 CON1.D6
+5V/3
  Top 0.61: CON_UC.1 48.35,82.65 47,84 20.48,84 20.24,84.24 | CON1.C6 20.24,84.24 | 20.24,84.24 15,79 5.27,79 JP4.2
  Bottom 0.813: JP5.2 JP4.2
CLK  (via drill 0.6)
  Top 0.305: v49,34 49,41 49.5,41.5 49.5,43.59 CON1.A17
  Bottom 0.305: AD9708.28 59.74,23.25 v49,34
CLK_SC  (via drill 0.6)
  Top 0.406: v60,70 v66,70
  Bottom 0.406: CON1.A15 41.8,46.2 41.8,51.8 v60,70 | v66,70 95.81,70 SCIO.4
COMP1
  Bottom 0.406: C8.2 73.75,17.55 71.2,20.1 71.2,22.38 AD9708.19
COMP2
  Bottom 0.406: C7.1 66.09,20.09 AD9708.23
DAC_OUT_NET
  Bottom 0.406: 82.27,10 JP1.1 | RG2.1 76.85,3 82,3 82.27,3.27 DAC_T.4
  Bottom 0.61: DAC_T.4 DAC_T.2 82.27,10 | JP1.1 84.27,12 DAC_OUT.1 TP_OUT.TP
DB0
  Bottom 0.305: AD9708.8 68.64,33.63 78.6,43.6 78.6,44.84 CON1.A29
DB1
  Bottom 0.305: CON1.A27 73.58,40 67.36,33.78 AD9708.7
DB2
  Bottom 0.305: 71.04,47.36 72.3,46.1 72.3,41 66.09,34.8 AD9708.6
  Bottom 0.406: 71.04,47.36 CON1.B26
DB3
  Bottom 0.305: 70.9,44.77 70.9,41 64.83,34.92 AD9708.5
  Bottom 0.406: 70.9,44.77 CON1.A26
DB4
  Bottom 0.305: 69.9,43.6 69.9,41 63.55,34.66 AD9708.4
  Bottom 0.406: CON1.A25 68.59,44.91 69.9,43.6
DB5
  Bottom 0.305: 68.44,47.45 67.2,46.2 67.2,40 62.28,35.09 AD9708.3
  Bottom 0.406: 68.44,47.45 CON1.B25
DB6
  Bottom 0.305: 64.7,43.7 64.7,39.7 61.02,36.02 AD9708.2
  Bottom 0.406: CON1.A24 65.91,44.91 64.7,43.7
DB7
  Bottom 0.305: 64.72,46.2 CON1.B24 | 62.6,46.2 62.1,45.7 62.1,39.1 59.74,36.74 AD9708.1
  Bottom 0.406: 62.6,46.2 64.72,46.2
FSADJ
  Bottom 0.61: AD9708.18 72.44,26.45 74,28 RADJ.1
GCLK2
  Bottom 0.406: CON1.D22 60.88,89.58 62.2,90.9 62.2,93.2 61.6,93.8 54.74,93.8 JP7.3
GCLK3
  Bottom 0.406: CON1.C21 58.19,86.81 57,88 47.2,88 46.9,88.3 46.9,95.44 JP7.1
GCLK28
  Bottom 0.406: CON1.C22 60.88,87.02 59.6,88.3 59.6,90.2 59.2,90.6 49.6,90.6 49.4,90.8 49.4,95.4 JP7.2
GND  (via drill 0.6)
  other vias: 8,13 12,17 15,20 21,26 28,29 32,29 36,29 23,40 26,40 12,37 17,16 17,19 13,9 22,9 14,7 21,7 50,31 52.1,32.9 53.4,31.6 50.9,34.1 47,29.3 48.4,27.9 7,55 19,50 16,50 9,55 13,50 15,84 17,84 13,84 33,81 94,88 96,88 98,88 21,93 10,50 14,39 18,39.3 97,58 97,55 97,52 97,49 89,49 89,47 76,37 79,37 82,37 2.4,40 19,79 23,79 26,79 9,77 12,78 12,71 19,71 23,71 23,74 27,74 19,65 15,65 9,63 17,58 13,58 15,58 71,84 71,81 86,81 86,84
  pour Top (isolate 0.406): 0,100 0,0 24,0 24,27 50,27 59,36 84,36 92,28 100,28 101,100
  pour Bottom (isolate 0.406): 0,100 0,0 24,0 24,27 50,27 59,36 84,36 92,28 100,28 101,100
GND1  (via drill 0.6)
  other vias: 26,8 30,8 60,28 69,28 66,28 69,26 60,26 75,25 79,25 79,30 52,24 57,29 54,21 26,16 30,16 34,16 37,16 40,16 43,16 46,16 48,16 52,16 55,18 55,16 26,13 30,13 34,13 37,13 40,13 43,13 46,13 48,13 59.6,12.3 58.1,12.3 62,11 64,14 80,11 80,13 80,14.6 64.7,2 66,2 87,18 95,11 95,13 95,15 44,2 40,2 42,4 42,6 42,2 38,2 36,2 42,22 42,19 36,19 36,22 85,17 93,18 83,16 95,9 95,17 95,7 51,2 49,2 36,6 36,4 34,2 63,28 63,26 66,26 72,29 52,12.9 73,6 74,5
  pour Bottom (isolate 0.406): 25,26 51,26 60,35 83,35 92,26 100,26 100,0 25,0
  pour Top (isolate 0.406): 25,0 25,26 51,26 60,35 83,35 92,26 100,26 100,0
IO  (via drill 0.6)
  Top 0.406: v66.3,67.6 51.4,67.6 v50,69
  Bottom 0.406: CON1.B9 49.41,69 v50,69 | SCIO.3 66.35,67.65 v66.3,67.6
IOUTA
  Bottom 0.406: AD9708.22 67.36,16.95 RS2.1 66.3,16.95 arc90 RL1.2
IOUTB
  Bottom 0.406: AD9708.21 68.64,19.32 RS1.2 72.2,16.95 RL2.2
N$1
  Bottom 0.305: 38.02,44.82 36.9,43.7 34.5,43.7 34.2,43.4 34.2,40.2 32,38 15,38 9.35,32.35 GPIO2.3
  Bottom 0.406: 38.02,44.82 CON1.A13
N$2  (via drill 0.6)
  Top 0.305: v34,38 36.2,38 v38.2,40
  Bottom 0.305: GPIO2.4 4.19,30 9,30 16,37 33,37 v34,38 | CON1.A18 50.72,44.62 49.5,43.4 49.5,41.5 49,41 40,41 39,40 v38.2,40
N$3  (via drill 0.6)
  Top 0.305: CON1.B18 49.58,46.3 37.3,46.3 36.7,45.7 36.7,40.7 v36,40
  Bottom 0.305: v36,40 36,37 35,36 17,36 8.27,27.27 GPIO2.5
N$4
  Bottom 0.305: CON1.A19 52,43.65 52,41 51,40 41,40 36,35 18,35 7.73,24.73 GPIO2.6
N$5
  Bottom 0.305: CON1.A20 54.5,43.6 54.5,40 53.5,39 42,39 37,34 19,34 7,22 4.19,22 GPIO2.7 5.19,22.19
N$6
  Bottom 0.305: GPIO2.8 6.65,19.65 20,33 38,33 43,38 54,38 57.1,41.1 57.1,46 55.8,47.3 CON1.B20
N$8  (via drill 0.6)
  Top 0.305: v57,39 57.6,39 59.6,41 59.6,48.8 59.8,49 73,49 73.58,48.42 CON1.B27
  Bottom 0.305: GPIO2.9 6.11,17.11 21,32 39,32 44,37 55,37 v57,39
N$9  (via drill 0.6)
  Top 0.305: CON1.A28 76.12,45.08 74.8,46.4 74.8,48.5 73.6,49.7 58.1,49.7 57.1,48.7 57.1,41 57,41 54,38 v54,36
  Bottom 0.305: GPIO2.10 5.57,14.57 22,31 41,31 46,36 v54,36
N$10
  Bottom 0.406: IC1.3 70.64,13.5 | 70.64,13.5 70.64,14.69 RS1.1 | RG.2 73.55,13.5 70.64,13.5
N$11
  Bottom 0.406: IC1.2 69.36,13.6 | 69.36,13.6 69.36,14.29 RS2.2 | RF.1 66.65,12.65 67.6,13.6 69.36,13.6
N$12
  Bottom 0.406: RF.2 65.7,10 68.09,10 | IC1.1 68.09,10 | 68.09,10 68.09,9.61 68.9,8.8 72,8.8 | RO.2 79.73,5.05 DAC_T.3
  Bottom 0.61: 72,8.8 75.75,5.05 RO.2
N$14
  Bottom 0.813: U$3.3 9.95,58.65 R5.1
N$15
  Bottom 0.813: U$2.3 8.93,66.27 JP2.1
N$16
  Bottom 0.813: JP3.1 5.03,57.7 R5.2
N$18
  Bottom 0.406: RO.1 79.73,6.95 DAC_T.1
N$19
  Bottom 0.61: R_POT.1 89.68,24.27 RADJ.2
N$20
  Bottom 0.813: R6.1 12.05,75 U$5.3
N$22
  Bottom 0.813: U$4.3 7.93,81.27 JP4.1
N$23
  Bottom 0.813: R6.2 8.82,73.73 JP5.1
N$24
  Bottom 0.406: IC1.6 70.64,4.6 71.4,4.6 RF2.1 72.95,2.7 RG2.2
N$25
  Bottom 0.254: GPIO.3 22.65,92.03 CON1.D8
N$26
  Bottom 0.254: GPIO.4 25.19,92.03 CON1.D9
N$27
  Bottom 0.254: GPIO.5 27.73,92.37 29.1,91 29.1,89.9 29.6,89.4 30.36,89.4 CON1.D10
N$28
  Bottom 0.254: GPIO.6 30.27,94.53 31.6,93.2 31.6,90.69 CON1.D11
N$29
  Bottom 0.254: GPIO.7 32.81,94.69 34.2,93.3 34.2,90.64 CON1.D12
N$30
  Bottom 0.254: GPIO.8 35.35,94.55 36.7,93.2 36.7,90.67 CON1.D13
N$31
  Bottom 0.254: GPIO.9 37.89,94.81 39.2,93.5 39.2,90.72 CON1.D14
N$32
  Bottom 0.254: GPIO.10 40.43,94.77 41.7,93.5 41.7,90.75 CON1.D15
N$33  (via drill 0.6)
  Top 0.406: TP_OUT1.TP v83,2
  Bottom 0.406: IC1.7 69.36,4.38 RF2.2 70.55,1.45 71,1 82,1 v83,2
N$34
  Top 0.813: LED2.A R_LED2.1
N$35
  Top 0.61: 93.25,45.3 92.95,45.6 LED1.A
  Top 0.813: 93.25,45.3 R_LED1.1
N$50
  Top 0.813: LED3.A R_LED3.1
N$51
  Top 0.813: LED4.A R_LED4.1
N$53
  Top 0.813: CON1.B30 81.2,48.2 85,52 R_LED2.2
N$54
  Top 0.813: R_LED1.2 91.05,44.05 89,42 82.3,42 81.2,43.1 CON1.A30
N$55
  Top 0.813: CON1.B29 78.66,50.66 83,55 R_LED3.2
N$56
  Top 0.813: CON1.B28 76.12,52.12 82,58 R_LED4.2
N$60
  Bottom 0.61: CON1.C13 38.02,81.17 CON_UC.5
N$61
  Bottom 0.61: CON_UC.4 40.56,81.17 CON1.C14
N$62
  Bottom 0.61: CON_UC.3 43.1,81.17 CON1.C15
N$63
  Bottom 0.61: CON_UC.2 45.64,81.17 CON1.C16
PIN4
  Bottom 0.406: CON1.B14 40,48.01 40,53 62,75 63,75 64,75 90.65,75 SCIO.8
PIN6
  Bottom 0.406: CON1.A12 34.2,46.19 34.2,50.3 49.9,66 50,66 61,77 87,77 92.89,82.89 SCIO.9
PIN8  (via drill 0.6)
  Top 0.406: SCIO.7 87.19,77.81 86,79 v83,79
  Bottom 0.406: CON1.A9 26.6,46.16 26.6,49.6 48,71 53,71 61,79 v83,79
REFIO
  Bottom 0.406: AD9708.17 73.72,21.29 75.3,19.7 C6.1
RST
  Bottom 0.406: CON1.B15 43,47.55 43,50 65.73,72.73 SCIO.5
SHDN
  Top 0.406: SCIO.6 84.27,75.27 71,62 62,62 48.18,48.18 CON1.B17
T1
  Bottom 0.305: R2.2 24.05,67.05 33,76 49,76 56,83 63.1,83 64.7,84.6 64.7,88.09 CON1.D24
  Bottom 0.813: U$2.1 11.2,67.05 R2.2
T2
  Bottom 0.305: R1.2 20.05,61.05 34,75 49,75 56,82 64,82 66,84 66,86.78 CON1.C24
  Bottom 0.813: U$3.1 R1.2
T3
  Bottom 0.305: R3.2 15.05,81 28,81 31,78 49,78 55.9,84.9 61,84.9 62.2,86.1 62.2,88 63.42,89.22 CON1.D23
  Bottom 0.813: U$4.1 11.1,80.95 R3.2
T4
  Bottom 0.305: R4.2 30.95,75.95 32,77 49,77 56,84 62,84 63,85 63,86.39 CON1.C23
  Bottom 0.813: U$5.1 15.1,75.95 R4.2
V+
  Top 0.813: CN+.P$1 CN+.P$2
  Bottom 0.813: OP_VCC.3 62.54,4.36 61.3,5.6 57.8,5.6 57.1,6.3 D2.A 35,8 31.25,4.25 CN+.P$2
V-  (via drill 0.7)
  Top 0.813: CN-.P$1 49.95,10 | 49.95,10 CN-.P$2 | v50.8,10 49.95,10
  Bottom 0.813: OP_VCC.1 55.46,5 50.7,5 arc90 CN-.P$2 | D1.C v50.8,10 50,10 v50,11.3
VCC+
  Bottom 0.61: C5.1 arc90 68.09,4.09 IC1.8
  Bottom 0.813: D2.C 61.5,7.4 C9.1 66.3,4 C5.1
VCC-  (via drill 0.6, 0.7)
  Top 0.813: v75,8.8 61.2,8.8 v60,10 v58,10
  Bottom 0.406: IC1.4 71.9,9.8 74.8,9.8 75,10 | C4.1 75,10.6 75,10 | 75,10 v75,8.8
  Bottom 0.813: v60,10 v58,10 D1.A 56,10 C10.2
VCCIO
  Bottom 1.016: CON1.A7 22.78,44.78 19,41 13,41 9.43,37.43 8,37.43 | GPIO2.1 8,37.43 | C19.1 8,37.43
VEE  (via drill 0.6, 0.8)
  Top 0.813: v15,17 7.5,24.5 7.5,39.9 7.4,40 v5,40
  Bottom 0.813: CON1.B1 CON1.A1 5,42.37 v5,40 v6.4,40 | v15,17 15,14 | 15,14 15,13.41 U$1.1 | C1.1 15,14
VPP
  Bottom 0.406: CON1.B16 45,48.09 45,50 60.11,65.11 SCIO.2

### Text on the board
tNames: 3V3 | GND | 0 | 1 | 2 | 3 | 4 | 5 | 6 | 7 | CLK3 | CLK28 | CLK2 | GIAnT fault only 09/19 | IO1 | GND | T3 | P6 | 3V3 | P4 | 3V3 | P8 | SHDW | T4 | RST | CLK | GND | GND | I/O | T1 | 5V | 3V3 | GND | 5V | T2 | 3V3 | GND | (C) '19 / David Oswald | 0 | wrong => boom | 1 | 2 | GND | 3 | + | - | max -15V | 4 | +5V | 5 | 6 | 7 | IO2 | max +15V | 50R | GND | 0R | - | + | OUT_INV
bNames: GIAnT fault only 09/19 | WARNING: / HIGH FAULTAGE